# Altium schematic sheet MC21R01_uC_Power.SchDoc: MC21R01 Top Level
size A3; Author: AMP; DrawnBy: AMP; Organization: Altium Limited; Address1: 3 Minna Close; Address2: Belrose; Address3: NSW 2085; Address4: Australia; DocumentNumber: 0; Revision: 1.0; SheetNumber: 0; SheetTotal: 0
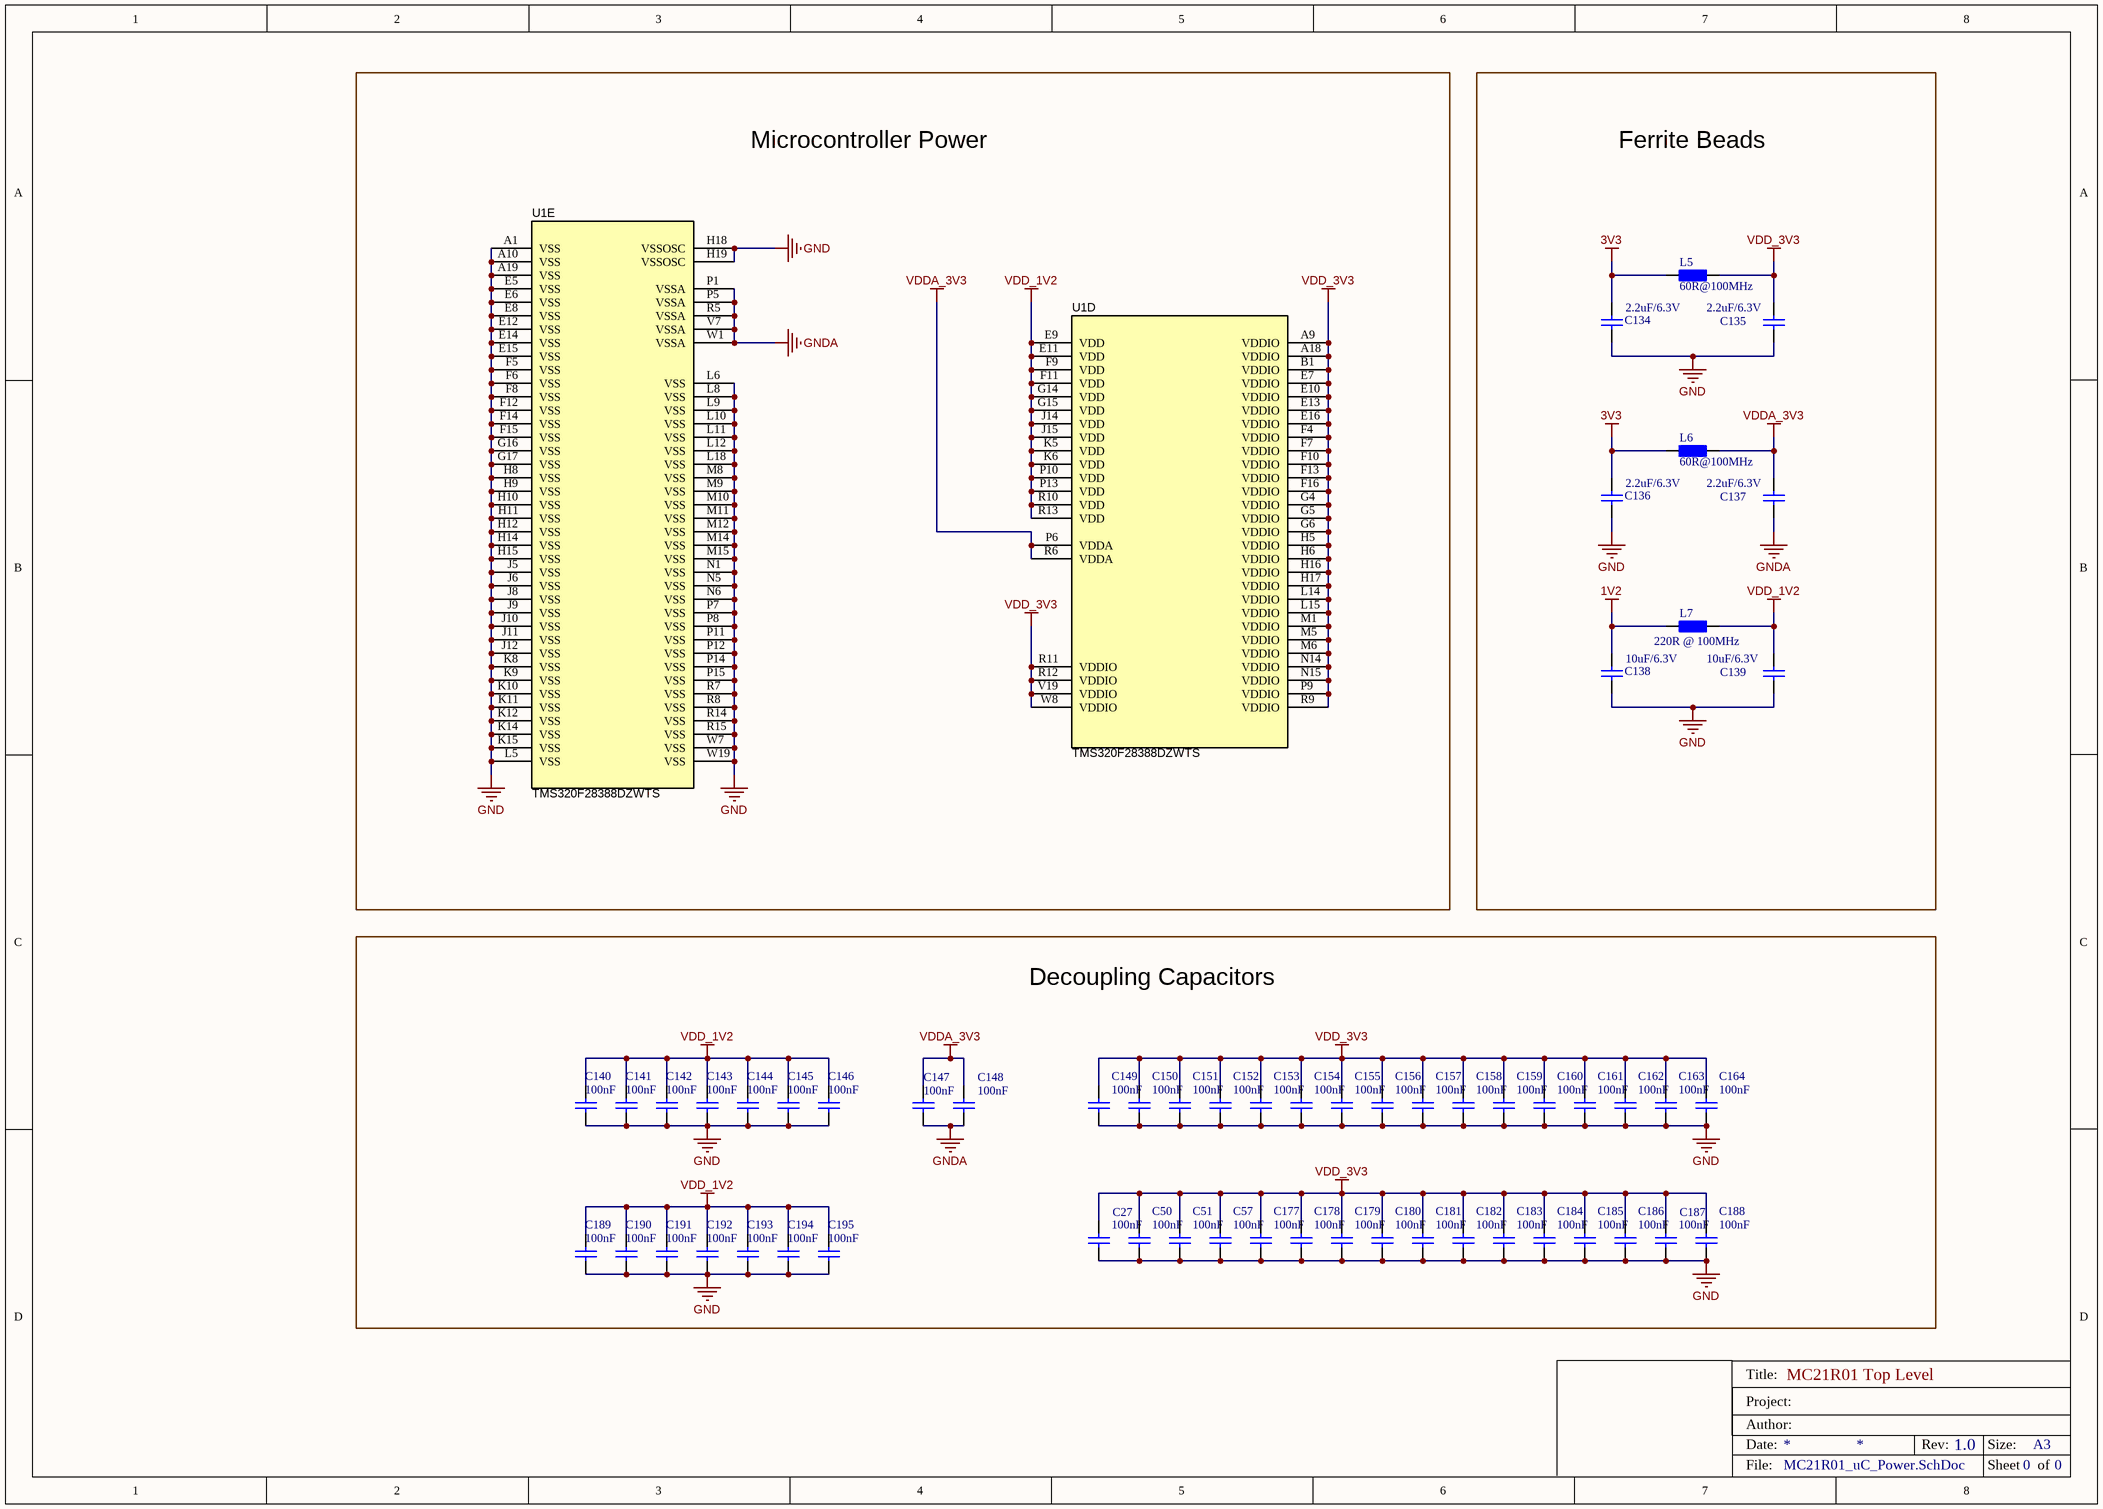
[diagram p0: MC21R01_uC_Power.SchDoc]

## Parts
C27  value 100nF  [CAPC0603X03N]  (hidden comment: 100nF/25V 0201 10% X6S)
C50  value 100nF  [CAPC0603X03N]  (hidden comment: 100nF/25V 0201 10% X6S)
C51  value 100nF  [CAPC0603X03N]  (hidden comment: 100nF/25V 0201 10% X6S)
C57  value 100nF  [CAPC0603X03N]  (hidden comment: 100nF/25V 0201 10% X6S)
C134  value 2.2uF/6.3V  [0402 SMD Capacitor]  (hidden comment: 2.2uF/6.3V 0402 10% X5R)
C135  value 2.2uF/6.3V  [0402 SMD Capacitor]  (hidden comment: 2.2uF/6.3V 0402 10% X5R)
C136  value 2.2uF/6.3V  [0402 SMD Capacitor]  (hidden comment: 2.2uF/6.3V 0402 10% X5R)
C137  value 2.2uF/6.3V  [0402 SMD Capacitor]  (hidden comment: 2.2uF/6.3V 0402 10% X5R)
C138  value 10uF/6.3V  [0402 SMD Capacitor]  (hidden comment: 10uF/6.3V 0402 20% X5R)
C139  value 10uF/6.3V  [0402 SMD Capacitor]  (hidden comment: 10uF/6.3V 0402 20% X5R)
C140  value 100nF  [CAPC0603X03N]  (hidden comment: 100nF/25V 0201 10% X6S)
C141  value 100nF  [CAPC0603X03N]  (hidden comment: 100nF/25V 0201 10% X6S)
C142  value 100nF  [CAPC0603X03N]  (hidden comment: 100nF/25V 0201 10% X6S)
C143  value 100nF  [CAPC0603X03N]  (hidden comment: 100nF/25V 0201 10% X6S)
C144  value 100nF  [CAPC0603X03N]  (hidden comment: 100nF/25V 0201 10% X6S)
C145  value 100nF  [CAPC0603X03N]  (hidden comment: 100nF/25V 0201 10% X6S)
C146  value 100nF  [CAPC0603X03N]  (hidden comment: 100nF/25V 0201 10% X6S)
C147  value 100nF  [CAPC0603X03N]  (hidden comment: 100nF/25V 0201 10% X6S)
C148  value 100nF  [CAPC0603X03N]  (hidden comment: 100nF/25V 0201 10% X6S)
C149  value 100nF  [CAPC0603X03N]  (hidden comment: 100nF/25V 0201 10% X6S)
C150  value 100nF  [CAPC0603X03N]  (hidden comment: 100nF/25V 0201 10% X6S)
C151  value 100nF  [CAPC0603X03N]  (hidden comment: 100nF/25V 0201 10% X6S)
C152  value 100nF  [CAPC0603X03N]  (hidden comment: 100nF/25V 0201 10% X6S)
C153  value 100nF  [CAPC0603X03N]  (hidden comment: 100nF/25V 0201 10% X6S)
C154  value 100nF  [CAPC0603X03N]  (hidden comment: 100nF/25V 0201 10% X6S)
C155  value 100nF  [CAPC0603X03N]  (hidden comment: 100nF/25V 0201 10% X6S)
C156  value 100nF  [CAPC0603X03N]  (hidden comment: 100nF/25V 0201 10% X6S)
C157  value 100nF  [CAPC0603X03N]  (hidden comment: 100nF/25V 0201 10% X6S)
C158  value 100nF  [CAPC0603X03N]  (hidden comment: 100nF/25V 0201 10% X6S)
C159  value 100nF  [CAPC0603X03N]  (hidden comment: 100nF/25V 0201 10% X6S)
C160  value 100nF  [CAPC0603X03N]  (hidden comment: 100nF/25V 0201 10% X6S)
C161  value 100nF  [CAPC0603X03N]  (hidden comment: 100nF/25V 0201 10% X6S)
C162  value 100nF  [CAPC0603X03N]  (hidden comment: 100nF/25V 0201 10% X6S)
C163  value 100nF  [CAPC0603X03N]  (hidden comment: 100nF/25V 0201 10% X6S)
C164  value 100nF  [CAPC0603X03N]  (hidden comment: 100nF/25V 0201 10% X6S)
C177  value 100nF  [CAPC0603X03N]  (hidden comment: 100nF/25V 0201 10% X6S)
C178  value 100nF  [CAPC0603X03N]  (hidden comment: 100nF/25V 0201 10% X6S)
C179  value 100nF  [CAPC0603X03N]  (hidden comment: 100nF/25V 0201 10% X6S)
C180  value 100nF  [CAPC0603X03N]  (hidden comment: 100nF/25V 0201 10% X6S)
C181  value 100nF  [CAPC0603X03N]  (hidden comment: 100nF/25V 0201 10% X6S)
C182  value 100nF  [CAPC0603X03N]  (hidden comment: 100nF/25V 0201 10% X6S)
C183  value 100nF  [CAPC0603X03N]  (hidden comment: 100nF/25V 0201 10% X6S)
C184  value 100nF  [CAPC0603X03N]  (hidden comment: 100nF/25V 0201 10% X6S)
C185  value 100nF  [CAPC0603X03N]  (hidden comment: 100nF/25V 0201 10% X6S)
C186  value 100nF  [CAPC0603X03N]  (hidden comment: 100nF/25V 0201 10% X6S)
C187  value 100nF  [CAPC0603X03N]  (hidden comment: 100nF/25V 0201 10% X6S)
C188  value 100nF  [CAPC0603X03N]  (hidden comment: 100nF/25V 0201 10% X6S)
C189  value 100nF  [CAPC0603X03N]  (hidden comment: 100nF/25V 0201 10% X6S)
C190  value 100nF  [CAPC0603X03N]  (hidden comment: 100nF/25V 0201 10% X6S)
C191  value 100nF  [CAPC0603X03N]  (hidden comment: 100nF/25V 0201 10% X6S)
C192  value 100nF  [CAPC0603X03N]  (hidden comment: 100nF/25V 0201 10% X6S)
C193  value 100nF  [CAPC0603X03N]  (hidden comment: 100nF/25V 0201 10% X6S)
C194  value 100nF  [CAPC0603X03N]  (hidden comment: 100nF/25V 0201 10% X6S)
C195  value 100nF  [CAPC0603X03N]  (hidden comment: 100nF/25V 0201 10% X6S)
L5  60R@100MHz  [0603 SMD inductor]
L6  60R@100MHz  [0603 SMD inductor]
L7  220R @ 100MHz  [0603 SMD inductor]
U1  TMS320F28388DZWTS  [ZWT0337A]  (parts D,E of 5)

## Blocks framed on the sheet
Microcontroller Power: U1
Ferrite Beads: C134-C139 L5-L7
Decoupling Capacitors: C27 C50 C51 C57 C140-C164 C177-C195

## Nets
1V2: C138.1 L7.2
3V3: C134.1 C136.1 L5.2 L6.2
GND: C27.1 C50.1 C51.1 C57.1 C134.2 C135.2 C136.2 C138.2 C139.2 C140.1 C141.1 C142.1 C143.1 C144.1 C145.1 C146.1 C149.1 C150.1 C151.1 C152.1 C153.1 C154.1 C155.1 C156.1 C157.1 C158.1 C159.1 C160.1 C161.1 C162.1 C163.1 C164.1 C177.1 C178.1 C179.1 C180.1 C181.1 C182.1 C183.1 C184.1 C185.1 C186.1 C187.1 C188.1 C189.1 C190.1 C191.1 C192.1 C193.1 C194.1 C195.1 U1.A1(VSS) U1.A10(VSS) U1.A19(VSS) U1.E5(VSS) U1.E6(VSS) U1.E8(VSS) U1.E12(VSS) U1.E14(VSS) U1.E15(VSS) U1.F5(VSS) U1.F6(VSS) U1.F8(VSS) U1.F12(VSS) U1.F14(VSS) U1.F15(VSS) U1.G16(VSS) U1.G17(VSS) U1.H8(VSS) U1.H9(VSS) U1.H10(VSS) U1.H11(VSS) U1.H12(VSS) U1.H14(VSS) U1.H15(VSS) U1.H18(VSSOSC) U1.H19(VSSOSC) U1.J5(VSS) U1.J6(VSS) U1.J8(VSS) U1.J9(VSS) U1.J10(VSS) U1.J11(VSS) U1.J12(VSS) U1.K8(VSS) U1.K9(VSS) U1.K10(VSS) U1.K11(VSS) U1.K12(VSS) U1.K14(VSS) U1.K15(VSS) U1.L5(VSS) U1.L6(VSS) U1.L8(VSS) U1.L9(VSS) U1.L10(VSS) U1.L11(VSS) U1.L12(VSS) U1.L18(VSS) U1.M8(VSS) U1.M9(VSS) U1.M10(VSS) U1.M11(VSS) U1.M12(VSS) U1.M14(VSS) U1.M15(VSS) U1.N1(VSS) U1.N5(VSS) U1.N6(VSS) U1.P7(VSS) U1.P8(VSS) U1.P11(VSS) U1.P12(VSS) U1.P14(VSS) U1.P15(VSS) U1.R7(VSS) U1.R8(VSS) U1.R14(VSS) U1.R15(VSS) U1.W7(VSS) U1.W19(VSS)
GNDA: C137.2 C147.1 C148.1 U1.P1(VSSA) U1.P5(VSSA) U1.R5(VSSA) U1.V7(VSSA) U1.W1(VSSA)
VDD_1V2: C139.1 C140.2 C141.2 C142.2 C143.2 C144.2 C145.2 C146.2 C189.2 C190.2 C191.2 C192.2 C193.2 C194.2 C195.2 L7.1 U1.E9(VDD) U1.E11(VDD) U1.F9(VDD) U1.F11(VDD) U1.G14(VDD) U1.G15(VDD) U1.J14(VDD) U1.J15(VDD) U1.K5(VDD) U1.K6(VDD) U1.P10(VDD) U1.P13(VDD) U1.R10(VDD) U1.R13(VDD)
VDD_3V3: C27.2 C50.2 C51.2 C57.2 C135.1 C149.2 C150.2 C151.2 C152.2 C153.2 C154.2 C155.2 C156.2 C157.2 C158.2 C159.2 C160.2 C161.2 C162.2 C163.2 C164.2 C177.2 C178.2 C179.2 C180.2 C181.2 C182.2 C183.2 C184.2 C185.2 C186.2 C187.2 C188.2 L5.1 U1.A9(VDDIO) U1.A18(VDDIO) U1.B1(VDDIO) U1.E7(VDDIO) U1.E10(VDDIO) U1.E13(VDDIO) U1.E16(VDDIO) U1.F4(VDDIO) U1.F7(VDDIO) U1.F10(VDDIO) U1.F13(VDDIO) U1.F16(VDDIO) U1.G4(VDDIO) U1.G5(VDDIO) U1.G6(VDDIO) U1.H5(VDDIO) U1.H6(VDDIO) U1.H16(VDDIO) U1.H17(VDDIO) U1.L14(VDDIO) U1.L15(VDDIO) U1.M1(VDDIO) U1.M5(VDDIO) U1.M6(VDDIO) U1.N14(VDDIO) U1.N15(VDDIO) U1.P9(VDDIO) U1.R9(VDDIO) U1.R11(VDDIO) U1.R12(VDDIO) U1.V19(VDDIO) U1.W8(VDDIO)
VDDA_3V3: C137.1 C147.2 C148.2 L6.1 U1.P6(VDDA) U1.R6(VDDA)

## Notes on the sheet
- Title:
- Date:
- Project:
- Author:
- Rev:
- Size:
- A3
- File:
- Sheet
- of

## Library data of the parts
C27 C50 C51 C57 C140-C164 C177-C195 = CMP-001-00061-1: 100nF/25V 0201 10% Tolerance X6S Multilayer Ceramic Chip Capacitor; Populated: Yes; Provided by customer: No; Voltage Rating (DC): 25V; Capacitance: 100nF; Case/Package: 0201; Case Code (Imperial): 0201; Case Code (Metric): 0603; Dielectric: X6S; Height: 0.3mm; Length: 0.024inch; Max Operating Temperature: 105°C; Min Operating Temperature: -55°C; Mount: Surface Mount; Package Quantity: 15000; Packaging: Tape and Reel; Termination: SMD/SMT; Thickness: 0.013inch; Tolerance: 10%; Voltage Rating: 25V; Weight: 1.2E-05oz; Width: 0.3mm
C134-C137 = 2.2uF/6.3V 0402 10% X5R_1: 2.2uF/6.3V 0402 10% Tolerance X5R Multilayer Ceramic Chip Capacitor; Manufacturer 1: KEMET; Manufacturer Part Number 1: C0402C225K9PACTU; Supplier Part Number 1: 2442787; Supplier 1: Farnell
C138 C139 = 10uF/6.3V 0402 20% X5R: 10uF/6.3V 0402 20% Tolerance X5R Multilayer Ceramic Chip Capacitor; Manufacturer 1: KEMET; Manufacturer Part Number 1: C0402C106M9PACTU; Supplier Part Number 1: 2507061; Supplier 1: Farnell
L5 L6 = FB, 60 ohm, 0603 [1608 Metric], 3 A, 0.04 ohm, ± 25%: Ferrite Bead, 60 ohm, 0603 [1608 Metric], 3 A, 0.04 ohm, ± 25%; MPN: 742792602; MF: Wurth Electronik; DC Current Rating: 3A; DC Resistance Max:: 0.04R; Tolerance: ±25%; Impedance: 60R@100MHz; Supplier 1: Farnell; Supplier Part Number 1: 1635704
L7 = FB, 220 ohm, 0603 [1608 Metric], 2 A, 0.05 ohm, ± 25%: Ferrite Bead, 220 ohm, 0603 [1608 Metric], 2 A, 0.05 ohm, ± 25%; MPN: BLM18EG221SN1D; MF: MURATA; DC Current Rating: 2A; DC Resistance Max:: 0R05; Tolerance: ±25%; Impedance: 220R @ 100MHz; Supplier 1: Farnell; Supplier Part Number 1: 1515716
U1 = TMS320F28388: TMS320F28388DZWTS, ZWT0337A (NFBGA-337); Manufacturer: Texas Instruments; SizeAreaWB_mm2: 324; SizeArea_mm2: 256; AEC Qualified: N; AEC Category: Q200; SizeZ_mm: 1.4; SizeY_mm: 16; CompType: IC; ComponentLink1Description: Datasheet Link; ComponentLink2Description: Product Folder; PackageReference: ZWT0337A; PackageDescription: NFBGA-337; ComponentLink2URL: http://www.ti.com/product/tms320f28388d; Alternate Manufacturer: Texas Instruments; ComponentLink3URL: http://www.ti.com/product/tms320f28388d/datasheet; ComponentLink1URL: http://www.ti.com/lit/ds/symlink/tms320f28388d.pdf; MountType: SMT; ComponentLink3Description: Online Datasheet; SizeX_mm: 16; PartNumber: TMS320F28388DZWTS